# EAGLE schematic TemperatureMonitor-NTC (EAGLE 9.6.2)
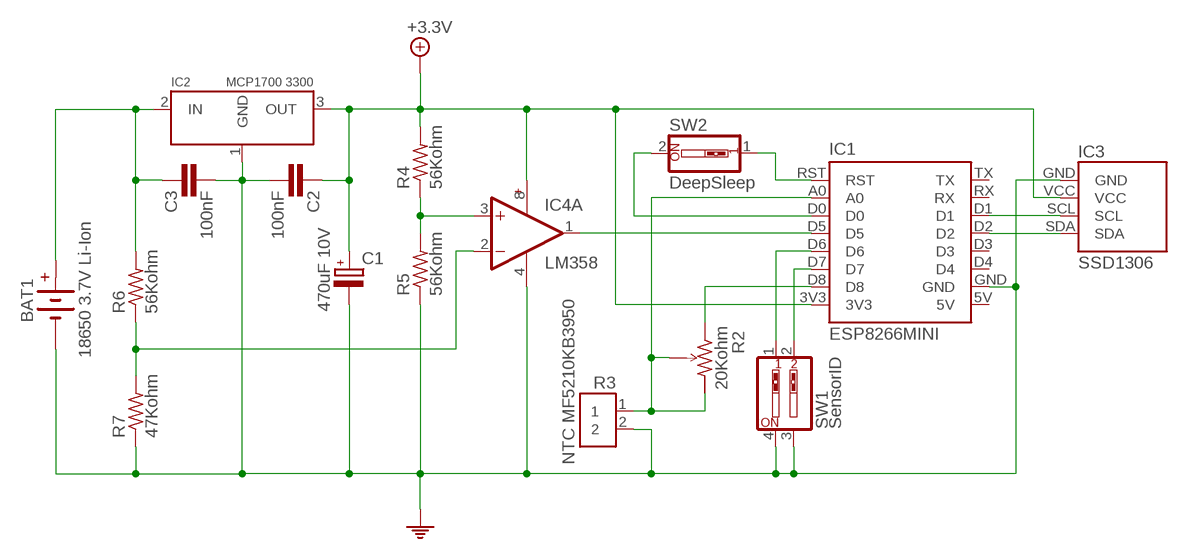
[diagram p0: schematic, sheet 1]

## Parts
BAT1  18650 3.7V Li-Ion  BATTERYSIL2  [SIL2]
C1  470uF 10V  CAPACITOR_EL5MM  [CAPACITOR-5MM]
C2  100nF  CAPACITOR5MM  [CAPACITOR-5MM]
C3  100nF  CAPACITOR5MM  [CAPACITOR-5MM]
IC1  ESP8266MINI  [ESP8266MINI]
IC2  MCP1700 3300  MCP1700  [TO92]
IC3  SSD1306  [SSD1306]
IC4  LM358  [DIL8]
R2  20Kohm  TRIMMERA  [TRIMMER-A]
R3  NTC MF5210KB3950  SIL2JST2  [JST2]
R4  56Kohm  RESISTOR0.25W  [RESISTOR-0.25W]
R5  56Kohm  RESISTOR0.25W  [RESISTOR-0.25W]
R6  56Kohm  RESISTOR0.25W  [RESISTOR-0.25W]
R7  47Kohm  RESISTOR0.25W  [RESISTOR-0.25W]
SW1  SensorID  DIP-SWITCH-2  [DIL4]
SW2  DeepSleep  DIP-SWITCH-1  [DIL2]

## Nets
+3.3V: C1.1 C2.1 IC1.3V3 IC2.3(OUT) IC3.VCC IC4.8(V+) R4.2
GND: BAT1.2(-) C1.2 C2.2 C3.1 IC1.GND IC2.1(GND) IC3.GND IC4.4(V-) R3.2 R5.1 R7.1 SW1.3 SW1.4
N$1: IC1.D2 IC3.SDA
N$2: IC1.D1 IC3.SCL
N$3: BAT1.1(+) C3.2 IC2.2(IN) R6.2
N$4: IC1.RST SW2.1
N$5: IC1.D8 R2.A
N$6: IC1.D7 SW1.2
N$7: IC1.A0 R2.B R2.C R3.1
N$8: IC1.D6 SW1.1
N$9: IC4.3(+IN) R4.1 R5.2
N$10: IC4.2(-IN) R6.1 R7.2
N$11: IC1.D5 IC4.1(OUT)
N$12: IC1.D0 SW2.2
Unconnected: IC1.D3 IC1.D4 IC1.RX IC1.TX IC4.5(+IN) IC4.6(-IN) IC4.7(OUT)

## Power pins joined to a net without a drawn wire
5V: IC1.5V

## Library data of the parts
BAT1 = wizzent:BATTERY: Battery
C1 = wizzent:CAPACITOR_EL: Electrolytic Capacitor
C2 C3 = wizzent:CAPACITOR: Capacitor
IC1 = wizzent:ESP8266MINI: ESP8266 Mini
IC2 = wizzent:MCP1700: MCP1700
IC3 = wizzent:SSD1306: SSD1306
IC4 = wizzent:LM358: LM358; SPICEPREFIX: J
R2 = wizzent:TRIMMER: Trimmer
R3 = wizzent:SIL2: JST Connector 2 PINs
R4-R7 = wizzent:RESISTOR: Resistor
SW1 = wizzent:DIP-SWITCH-2: DIP SWITCH 2
SW2 = wizzent:DIP-SWITCH-1: DIP SWITCH 1